# EAGLE design electronic_load_chip (EAGLE 7.3.0)

## Sheet 1 of 2
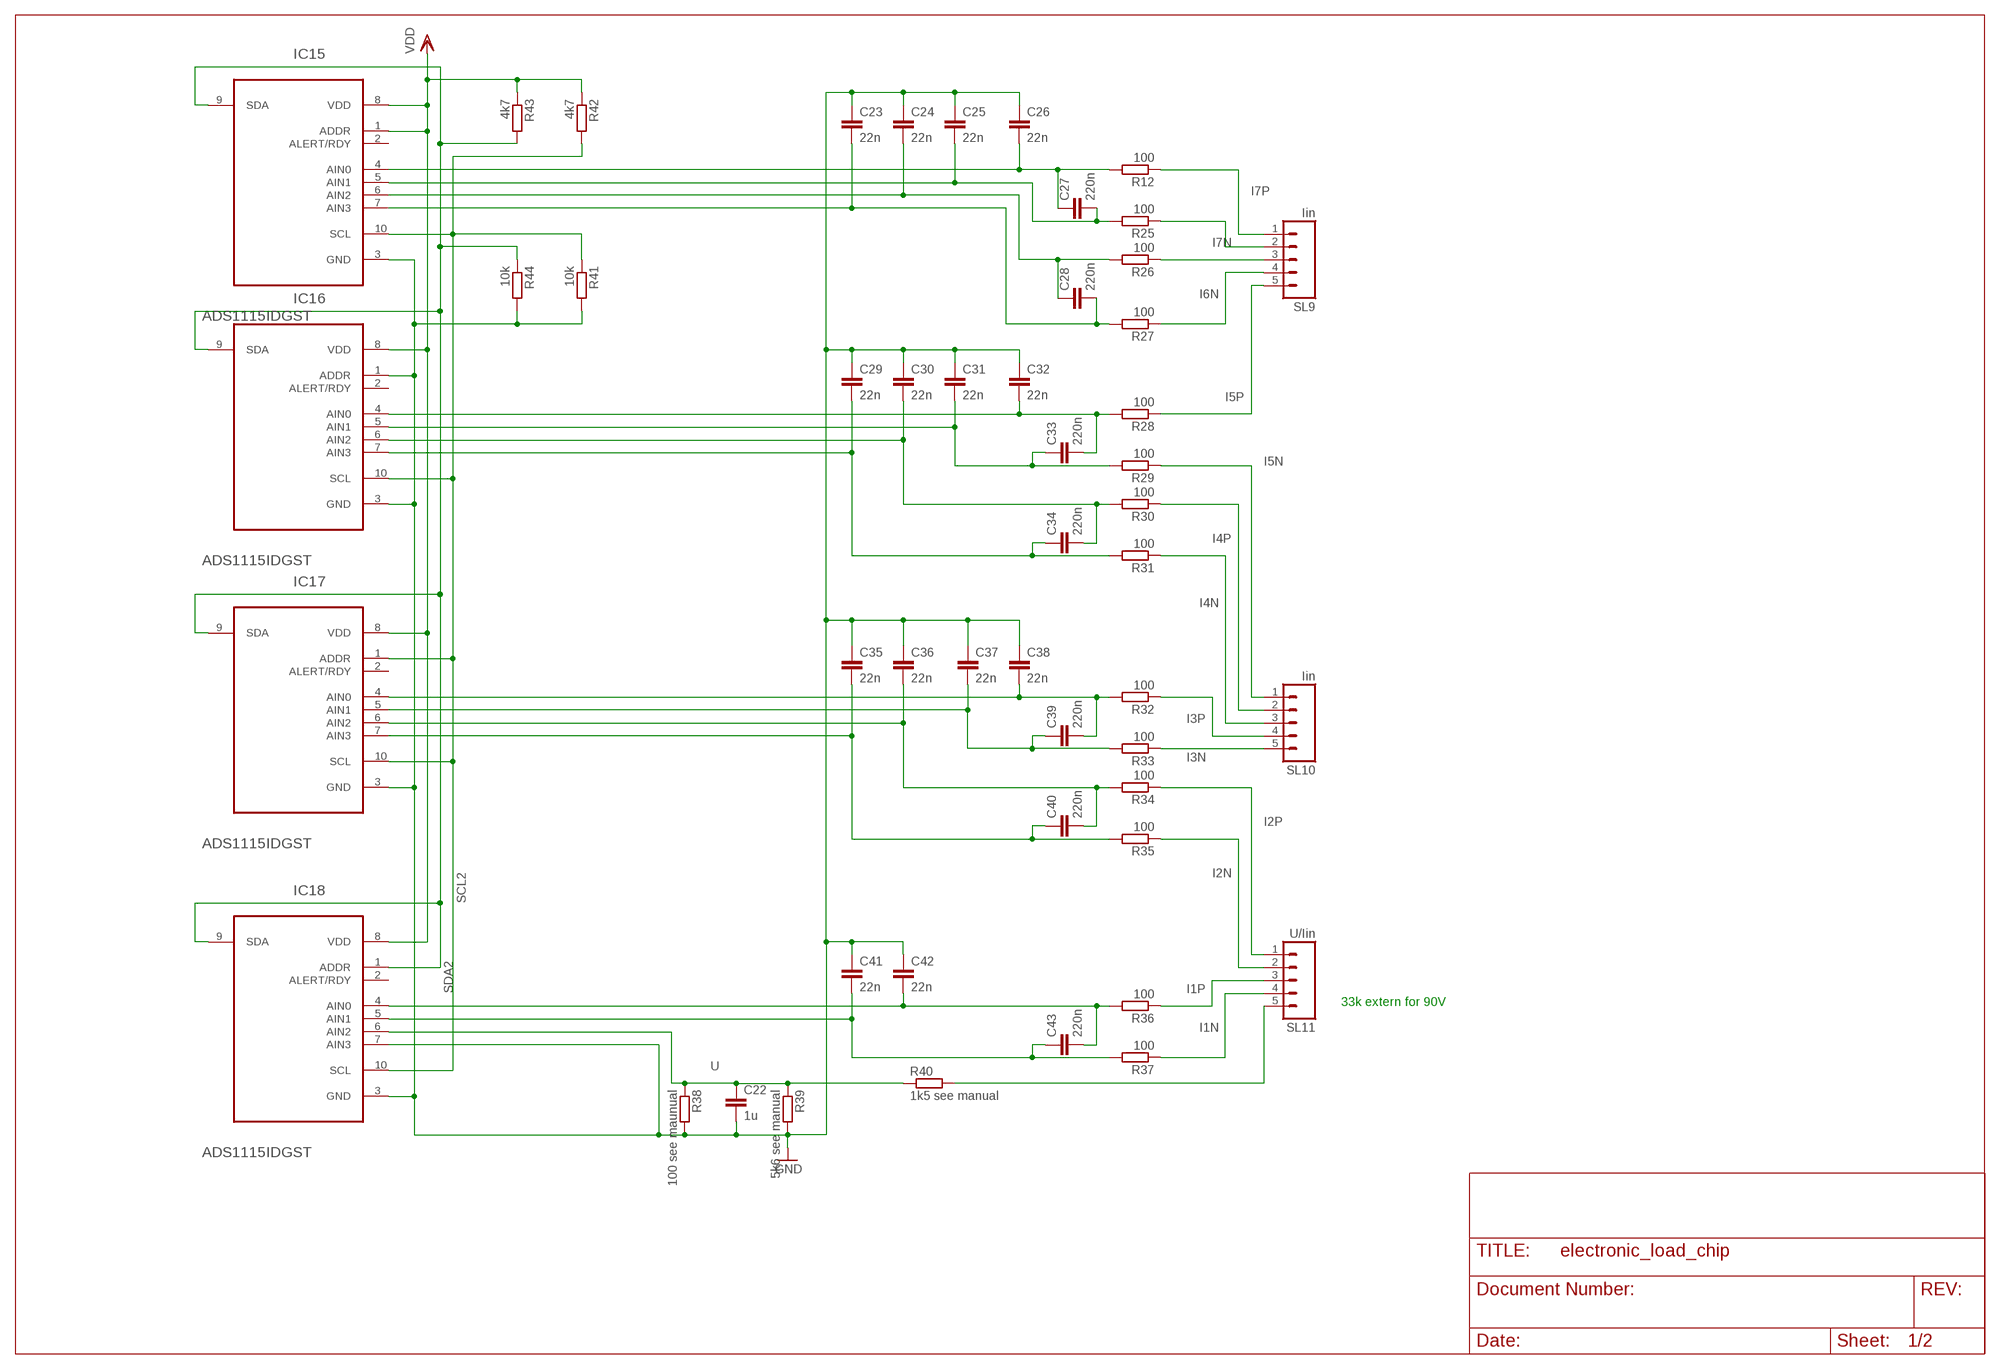
[diagram p0: schematic, sheet 1]

### Parts
C22  1u  C-EUC1206  [C1206]
C23  22n  C-EUC1206  [C1206]
C24  22n  C-EUC1206  [C1206]
C25  22n  C-EUC1206  [C1206]
C26  22n  C-EUC1206  [C1206]
C27  220n  C-EUC1206  [C1206]
C28  220n  C-EUC1206  [C1206]
C29  22n  C-EUC1206  [C1206]
C30  22n  C-EUC1206  [C1206]
C31  22n  C-EUC1206  [C1206]
C32  22n  C-EUC1206  [C1206]
C33  220n  C-EUC1206  [C1206]
C34  220n  C-EUC1206  [C1206]
C35  22n  C-EUC1206  [C1206]
C36  22n  C-EUC1206  [C1206]
C37  22n  C-EUC1206  [C1206]
C38  22n  C-EUC1206  [C1206]
C39  220n  C-EUC1206  [C1206]
C40  220n  C-EUC1206  [C1206]
C41  22n  C-EUC1206  [C1206]
C42  22n  C-EUC1206  [C1206]
C43  220n  C-EUC1206  [C1206]
IC15  ADS1115IDGST  [SOP50P490X110-10N]
IC16  ADS1115IDGST  [SOP50P490X110-10N]
IC17  ADS1115IDGST  [SOP50P490X110-10N]
IC18  ADS1115IDGST  [SOP50P490X110-10N]
R12  100  R-EU_R1206  [R1206]
R25  100  R-EU_R1206  [R1206]
R26  100  R-EU_R1206  [R1206]
R27  100  R-EU_R1206  [R1206]
R28  100  R-EU_R1206  [R1206]
R29  100  R-EU_R1206  [R1206]
R30  100  R-EU_R1206  [R1206]
R31  100  R-EU_R1206  [R1206]
R32  100  R-EU_R1206  [R1206]
R33  100  R-EU_R1206  [R1206]
R34  100  R-EU_R1206  [R1206]
R35  100  R-EU_R1206  [R1206]
R36  100  R-EU_R1206  [R1206]
R37  100  R-EU_R1206  [R1206]
R38  100 see maunual  R-EU_R1206  [R1206]
R39  5k6 see manual  R-EU_R1206  [R1206]
R40  1k5 see manual  R-EU_R1206  [R1206]
R41  10k  R-EU_R1206  [R1206]
R42  4k7  R-EU_R1206  [R1206]
R43  4k7  R-EU_R1206  [R1206]
R44  10k  R-EU_R1206  [R1206]
SL9  Iin  M05  [05P]
SL10  Iin  M05  [05P]
SL11  U/Iin  M05  [05P]

### Nets
GND: C22.2 C23.1 C24.1 C25.1 C26.1 C29.1 C30.1 C31.1 C32.1 C35.1 C36.1 C37.1 C38.1 C41.1 C42.1 IC15.3(GND) IC16.1(ADDR) IC16.3(GND) IC17.3(GND) IC18.3(GND) IC18.7(AIN3) R38.2 R39.2 R41.2 R44.2 ; also sheet 2
I1N: R37.1 SL11.4
I1P: R36.1 SL11.3
I2N: R35.1 SL11.2
I2P: R34.1 SL11.1
I3N: R33.1 SL10.5
I3P: R32.1 SL10.4
I4N: R31.1 SL10.3
I4P: R30.1 SL10.2
I5N: R29.1 SL10.1
I5P: R28.1 SL9.5
I6N: R27.1 SL9.4
I6P: R26.1 SL9.3
I7N: R25.1 SL9.2
I7P: R12.1 SL9.1
N$1: C26.2 C27.1 IC15.4(AIN0) R12.2
N$8: C32.2 C33.2 IC16.4(AIN0) R28.2
N$27: R40.2 SL11.5
N$29: C31.2 C33.1 IC16.5(AIN1) R29.2
N$30: C30.2 C34.2 IC16.6(AIN2) R30.2
N$32: C29.2 C34.1 IC16.7(AIN3) R31.2
N$45: C38.2 C39.2 IC17.4(AIN0) R32.2
N$48: C37.2 C39.1 IC17.5(AIN1) R33.2
N$49: C36.2 C40.2 IC17.6(AIN2) R34.2
N$70: C24.2 C28.1 IC15.6(AIN2) R26.2
N$71: C25.2 C27.2 IC15.5(AIN1) R25.2
N$72: C35.2 C40.1 IC17.7(AIN3) R35.2
N$74: C23.2 C28.2 IC15.7(AIN3) R27.2
N$76: C42.2 C43.2 IC18.4(AIN0) R36.2
N$78: C41.2 C43.1 IC18.5(AIN1) R37.2
SCL2: IC15.10(SCL) IC16.10(SCL) IC17.1(ADDR) IC17.10(SCL) IC18.10(SCL) R41.1 R42.2 ; also sheet 2
SDA2: IC15.9(SDA) IC16.9(SDA) IC17.9(SDA) IC18.1(ADDR) IC18.9(SDA) R43.2 R44.1 ; also sheet 2
U: C22.1 IC18.6(AIN2) R38.1 R39.1 R40.1
VDD: IC15.1(ADDR) IC15.8(VDD) IC16.8(VDD) IC17.8(VDD) IC18.8(VDD) R42.1 R43.1 ; also sheet 2
Unconnected: IC15.2(ALERT/RDY) IC16.2(ALERT/RDY) IC17.2(ALERT/RDY) IC18.2(ALERT/RDY)

### Notes on the sheet
- 33k extern for 90V

## Sheet 2 of 2
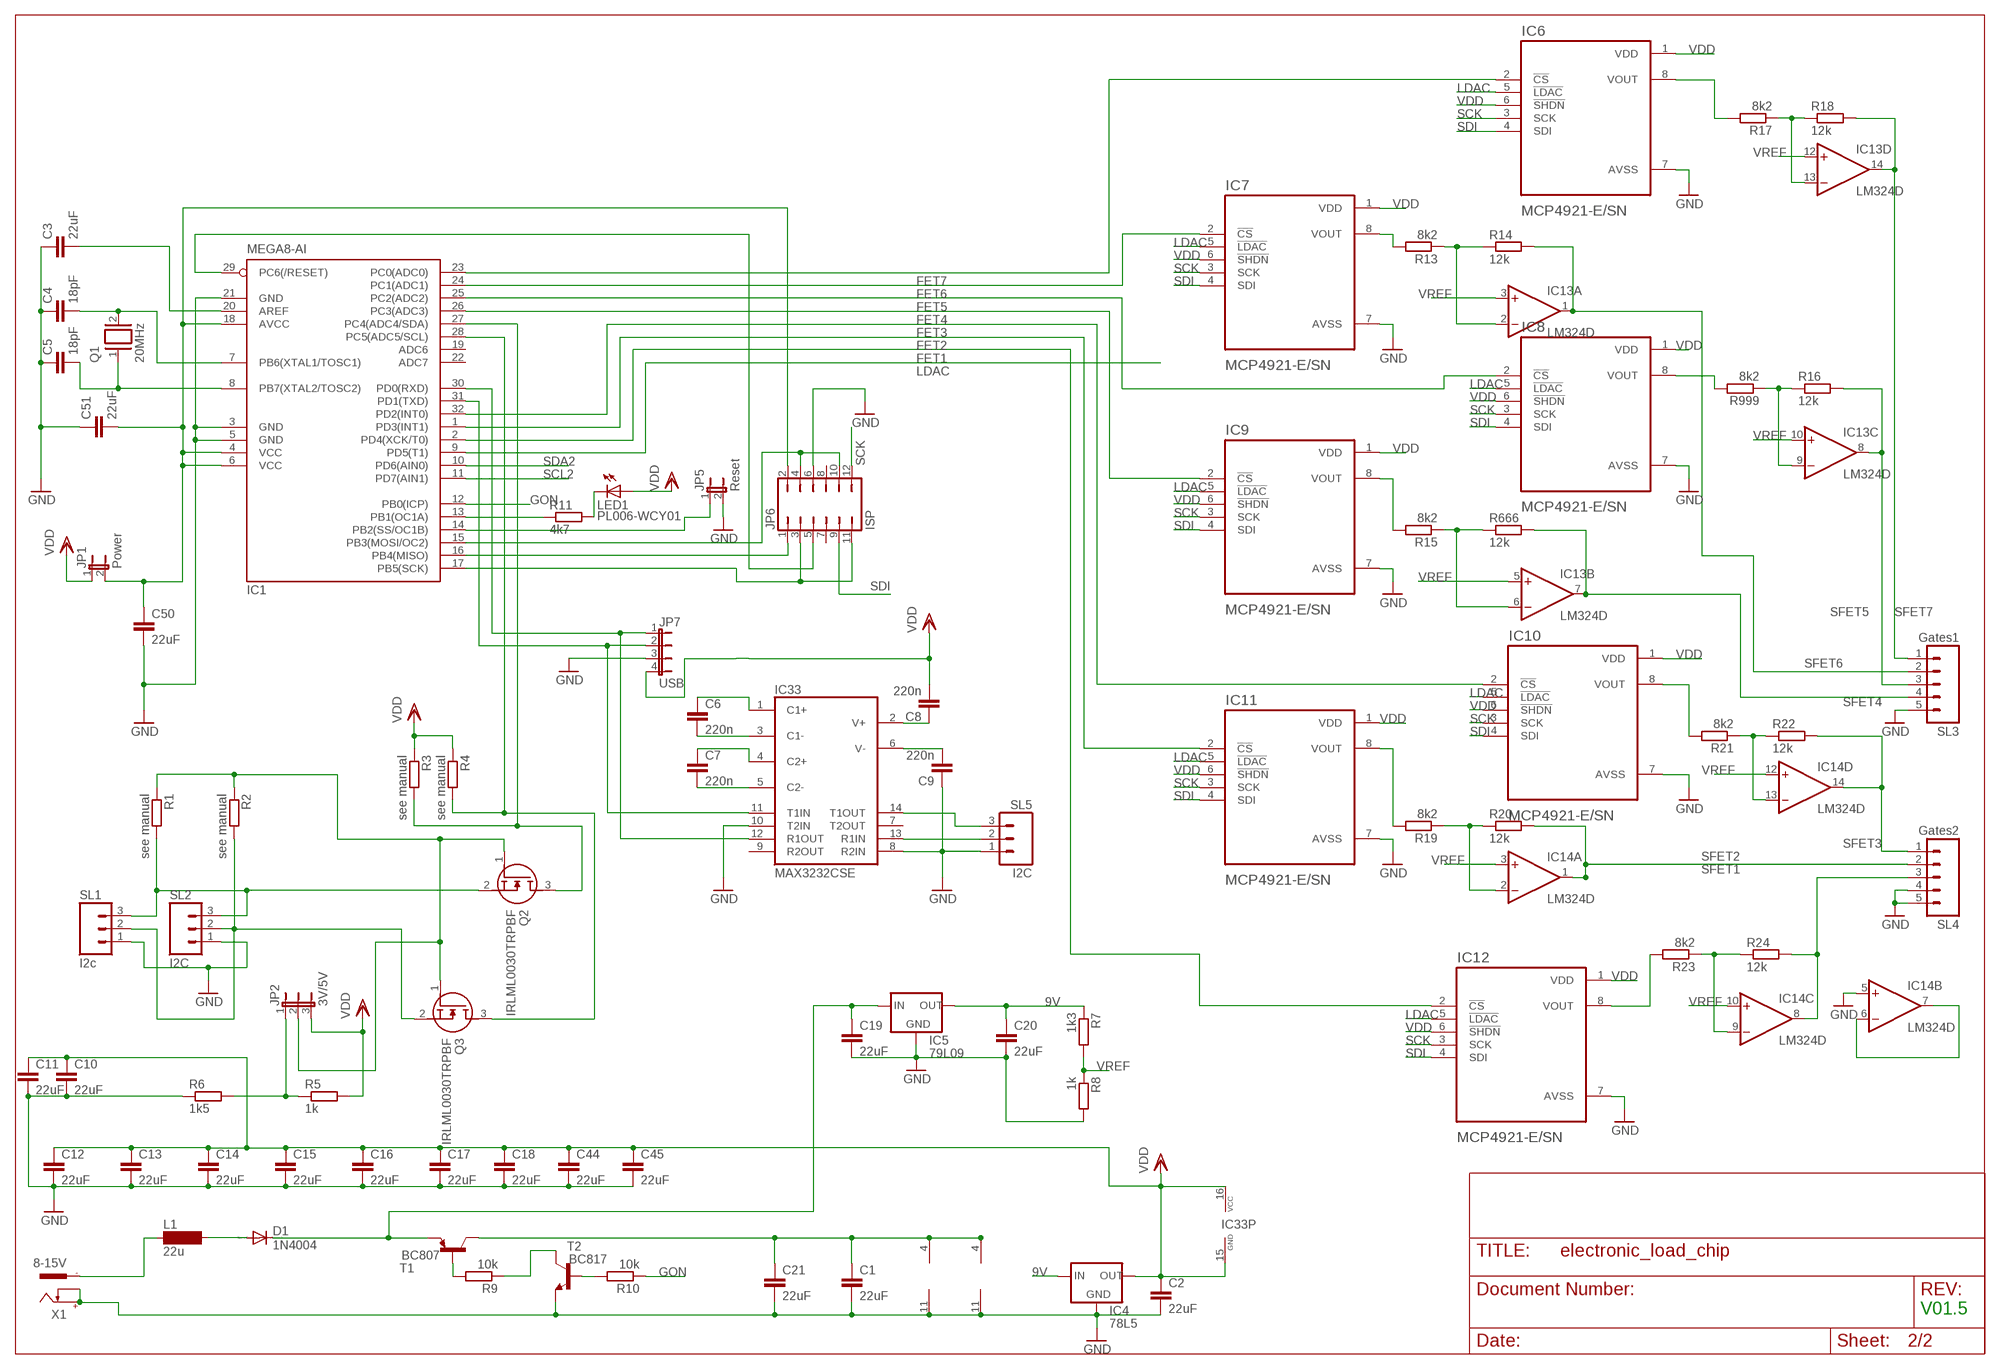
[diagram p1: schematic, sheet 2]

### Parts
C1  22uF  C-EUC1206  [C1206]
C2  22uF  C-EUC1206  [C1206]
C3  22uF  C-EUC1206  [C1206]
C4  18pF  C-EU025-025X050  [C025-025X050]
C5  18pF  C-EU025-025X050  [C025-025X050]
C6  220n  C-EUC1206  [C1206]
C7  220n  C-EUC1206  [C1206]
C8  220n  C-EUC1206  [C1206]
C9  220n  C-EUC1206  [C1206]
C10  22uF  C-EUC1206  [C1206]
C11  22uF  C-EUC1206  [C1206]
C12  22uF  C-EUC1206  [C1206]
C13  22uF  C-EUC1206  [C1206]
C14  22uF  C-EUC1206  [C1206]
C15  22uF  C-EUC1206  [C1206]
C16  22uF  C-EUC1206  [C1206]
C17  22uF  C-EUC1206  [C1206]
C18  22uF  C-EUC1206  [C1206]
C19  22uF  C-EUC1206  [C1206]
C20  22uF  C-EUC1206  [C1206]
C21  22uF  C-EUC1206  [C1206]
C44  22uF  C-EUC1206  [C1206]
C45  22uF  C-EUC1206  [C1206]
C50  22uF  C-EUC1206  [C1206]
C51  22uF  C-EUC1206  [C1206]
D1  1N4004  [DO41-10]
IC1  MEGA8-AI  [TQFP32-08]
IC4  78L5  78LXX  [78LXX]
IC5  79L09  78LXX  [78LXX]
IC6  MCP4921-E/SN  [SOIC127P600X175-8N]
IC7  MCP4921-E/SN  [SOIC127P600X175-8N]
IC8  MCP4921-E/SN  [SOIC127P600X175-8N]
IC9  MCP4921-E/SN  [SOIC127P600X175-8N]
IC10  MCP4921-E/SN  [SOIC127P600X175-8N]
IC11  MCP4921-E/SN  [SOIC127P600X175-8N]
IC12  MCP4921-E/SN  [SOIC127P600X175-8N]
IC13  LM324D  [SO14]
IC14  LM324D  [SO14]
IC33  MAX3232CSE  [SO16]
JP1  Power  JP1E  [JP1]
JP2  3V/5V  JP2E  [JP2]
JP5  Reset  JP1E  [JP1]
JP6  ISP  JP6Q  [JP6Q]
JP7  USB  JP4E  [JP4]
L1  22u  MS85  [MS85]
LED1  PL006-WCY01  [SOT23]
Q1  20MHz  XTAL/S  [QS]
Q2  IRLML0030TRPBF  [SOT95P237X112-3N]
Q3  IRLML0030TRPBF  [SOT95P237X112-3N]
R1  see manual  R-EU_R1206  [R1206]
R2  see manual  R-EU_R1206  [R1206]
R3  see manual  R-EU_R1206  [R1206]
R4  see manual  R-EU_R1206  [R1206]
R5  1k  R-EU_R1206  [R1206]
R6  1k5  R-EU_R1206  [R1206]
R7  1k3  R-EU_R1206  [R1206]
R8  1k  R-EU_R1206  [R1206]
R9  10k  R-EU_R1206  [R1206]
R10  10k  R-EU_R1206  [R1206]
R11  4k7  R-EU_R1206  [R1206]
R13  8k2  R-EU_R1206  [R1206]
R14  12k  R-EU_R1206  [R1206]
R15  8k2  R-EU_R1206  [R1206]
R16  12k  R-EU_R1206  [R1206]
R17  8k2  R-EU_R1206  [R1206]
R18  12k  R-EU_R1206  [R1206]
R19  8k2  R-EU_R1206  [R1206]
R20  12k  R-EU_R1206  [R1206]
R21  8k2  R-EU_R1206  [R1206]
R22  12k  R-EU_R1206  [R1206]
R23  8k2  R-EU_R1206  [R1206]
R24  12k  R-EU_R1206  [R1206]
R666  12k  R-EU_R1206  [R1206]
R999  8k2  R-EU_R1206  [R1206]
SL1  I2c  M03  [03P]
SL2  I2C  M03  [03P]
SL3  Gates1  M05  [05P]
SL4  Gates2  M05  [05P]
SL5  I2C  M03  [03P]
T1  BC807  BC807-16-PNP-SOT23-BEC  [SOT23-BEC]
T2  BC817  BC817-16-NPN-SOT23-BEC  [SOT23-BEC]
X1  8-15V  737992-55  [737992-5]

### Nets
9V: C20.1 IC4.IN IC5.OUT R7.1
C13: C6.1 IC33.1(C1+)
FET1: IC1.2(PD4(XCK/T0)) IC12.2(!CS)
FET2: IC1.1(PD3(INT1)) IC11.2(!CS)
FET3: IC1.32(PD2(INT0)) IC10.2(!CS)
FET4: IC1.26(PC3(ADC3)) IC9.2(!CS)
FET5: IC1.25(PC2(ADC2)) IC8.2(!CS)
FET6: IC1.24(PC1(ADC1)) IC7.2(!CS)
FET7: IC1.23(PC0(ADC0)) IC6.2(!CS)
GND: C1.2 C2.2 C3.1 C4.1 C5.1 C9.1 C10.2 C11.2 C12.2 C13.2 C14.2 C15.2 C16.2 C17.2 C18.2 C19.2 C20.2 C21.2 C44.2 C45.2 C50.2 C51.1 IC1.3(GND) IC1.5(GND) IC1.21(GND) IC4.GND IC5.GND IC6.7(AVSS) IC7.7(AVSS) IC8.7(AVSS) IC9.7(AVSS) IC10.7(AVSS) IC11.7(AVSS) IC12.7(AVSS) IC13.11(P:V-) IC14.5(B:+IN) IC14.11(P:V-) IC33.8(R2IN) IC33.10(T2IN) JP5.2 JP6.6 JP7.3 R6.1 R8.2 SL1.1 SL2.1 SL3.5 SL4.4 SL4.5 SL5.1 T2.E X1.+ X1.K ; also sheet 1
GON: IC1.12(PB0(ICP)) R10.1
LDAC: IC1.9(PD5(T1)) IC6.5(!LDAC) IC7.5(!LDAC) IC8.5(!LDAC) IC9.5(!LDAC) IC10.5(!LDAC) IC11.5(!LDAC) IC12.5(!LDAC)
N$2: IC8.8(VOUT) R999.2
N$3: C7.2 IC33.5(C2-)
N$4: C50.1 C51.2 IC1.4(VCC) IC1.6(VCC) IC1.18(AVCC) JP1.2 JP6.2
N$5: Q2.2(S) R1.2 SL1.3 SL2.3
N$6: IC1.31(PD1(TXD)) IC33.11(T1IN) JP7.2
N$7: L1.1 X1.-1
N$9: IC33.13(R1IN) SL5.2
N$11: C5.2 IC1.8(PB7(XTAL2/TOSC2)) Q1.1
N$12: D1.A L1.2
N$13: C7.1 IC33.4(C2+)
N$14: C6.2 IC33.3(C1-)
N$15: IC1.16(PB4(MISO)) JP6.1
N$16: C8.1 IC33.2(V+)
N$17: C9.2 IC33.6(V-)
N$18: IC1.29(PC6(/RESET)) JP6.5
N$19: C4.2 IC1.7(PB6(XTAL1/TOSC1)) Q1.2
N$20: IC12.8(VOUT) R23.2
N$21: IC6.8(VOUT) R17.2
N$22: Q3.2(S) R2.2 SL1.2 SL2.2
N$23: IC1.15(PB3(MOSI/OC2)) JP6.4 JP6.10
N$26: IC11.8(VOUT) R19.2
N$31: IC7.8(VOUT) R13.2
N$33: IC33.14(T1OUT) SL5.3
N$35: IC1.27(PC4(ADC4/SDA)) Q2.3(D) R3.2
N$36: IC13.13(D:-IN) R17.1 R18.1
N$37: IC1.14(PB2(SS/OC1B)) JP5.1
N$38: IC13.9(C:-IN) R16.1 R999.1
N$40: IC14.13(D:-IN) R21.1 R22.1
N$41: IC10.8(VOUT) R21.2
N$42: IC1.30(PD0(RXD)) IC33.12(R1OUT) JP7.1
N$43: LED1.3(C) R11.2
N$46: IC1.17(PB5(SCK)) JP6.3 JP6.11
N$50: IC1.28(PC5(ADC5/SCL)) Q3.3(D) R4.2
N$51: JP2.1 R5.1 R6.2
N$52: IC9.8(VOUT) R15.2
N$54: IC1.13(PB1(OC1A)) R11.1
N$56: C19.1 D1.C IC5.IN T1.E
N$57: IC14.2(A:-IN) R19.1 R20.1
N$58: IC14.9(C:-IN) R23.1 R24.1
N$59: C1.1 C21.1 IC13.4(P:V+) IC14.4(P:V+) T1.C
N$60: C3.2 IC1.20(AREF)
N$61: R9.2 T1.B
N$62: JP2.2 Q2.1(G) Q3.1(G) R1.1 R2.1
N$63: R9.1 T2.C
N$64: R10.2 T2.B
N$73: IC13.6(B:-IN) R15.1 R666.1
N$91: IC13.2(A:-IN) R13.1 R14.1
N$96: IC14.6(B:-IN) IC14.7(B:OUT)
SCK: IC6.3(SCK) IC7.3(SCK) IC8.3(SCK) IC9.3(SCK) IC10.3(SCK) IC11.3(SCK) IC12.3(SCK) JP6.12
SCL2: IC1.11(PD7(AIN1)) ; also sheet 1
SDA2: IC1.10(PD6(AIN0)) ; also sheet 1
SDI: IC6.4(SDI) IC7.4(SDI) IC8.4(SDI) IC9.4(SDI) IC10.4(SDI) IC11.4(SDI) IC12.4(SDI) JP6.9
SFET1: IC14.8(C:OUT) R24.2 SL4.3
SFET2: IC14.1(A:OUT) R20.2 SL4.2
SFET3: IC14.14(D:OUT) R22.2 SL4.1
SFET4: IC13.7(B:OUT) R666.2 SL3.4
SFET5: IC13.8(C:OUT) R16.2 SL3.3
SFET6: IC13.1(A:OUT) R14.2 SL3.2
SFET7: IC13.14(D:OUT) R18.2 SL3.1
VDD: C2.1 C8.2 C10.1 C11.1 C12.1 C13.1 C14.1 C15.1 C16.1 C17.1 C18.1 C44.1 C45.1 IC4.OUT IC6.1(VDD) IC6.6(!SHDN) IC7.1(VDD) IC7.6(!SHDN) IC8.1(VDD) IC8.6(!SHDN) IC9.1(VDD) IC9.6(!SHDN) IC10.1(VDD) IC10.6(!SHDN) IC11.1(VDD) IC11.6(!SHDN) IC12.1(VDD) IC12.6(!SHDN) IC33.15(GND) IC33.16(VCC) JP1.1 JP2.3 JP7.4 LED1.1(A) R3.1 R4.1 R5.2 ; also sheet 1
VREF: IC13.3(A:+IN) IC13.5(B:+IN) IC13.10(C:+IN) IC13.12(D:+IN) IC14.3(A:+IN) IC14.10(C:+IN) IC14.12(D:+IN) R7.2 R8.1
Unconnected: IC1.19(ADC6) IC1.22(ADC7) IC33.7(T2OUT) IC33.9(R2OUT) JP6.7 JP6.8 X1.-2

### Notes on the sheet
- V01.5

## Library data of the parts
C1-C3 C6-C21 C44 C45 C50 C51 = rcl:C-EU: CAPACITOR, European symbol
C4 C5 C22-C43 = resistor:C-EU: CAPACITOR, European symbol
D1 = diode:1N4004: DIODE general purpose rectifier, 1 A
IC1 = atmel:MEGA8: MICROCONTROLLER 8 Kbytes FLASH, 1 kbytes SRAM, 512 bytes EEPROM, USART, 6-channel 10 bit ADC, 2-channel 8 bit ADC Pin compatible with Atmega48, ATMega88, ATMega168 Source: avr.lbr; MPN: ATMEGA8-16AU; OC_FARNELL: 9171371; OC_NEWARK: 73M8863
IC4 IC5 = v-reg:78LXX: VOLTAGE REGULATOR
IC6-IC12 = MCP4921-E_SN:MCP4921-E/SN; AVAILABILITY: Unavailable; DESCRIPTION: 12 Bit Digital to Analog Converter 1 8-SOIC; MF: Microchip; MP: MCP4921-E/SN; PACKAGE: SOIC-8 Microchip; PRICE: None
IC13 IC14 = linear:LM324: OP AMP
IC15-IC18 = ADS1115IDGST:ADS1115IDGST: Analog-to-Digital Converter with Internal Reference; DESCRIPTION: 16 Bit Analog to Digital Converter 2, 4 Input 1 Sigma-Delta 10-VSSOP; MF: Texas Instruments; MP: ADS1115IDGST; PACKAGE: MSOP-10 Texas Instruments
IC33 = maxim:MAX3232*: True RS-232 Transceivers 3.0V to 5.5V, Low-Power up to 1Mbps, Using Four 0.1µF External Capacitors Source: http://pdfserv.maxim-ic.com/en/ds/MAX3222-MAX3241.pdf; MPN: MAX3232CSE; OC_FARNELL: 9725490; OC_NEWARK: 90C2890
JP1 JP5 = jumper:JP1E: JUMPER
JP2 = jumper:JP2E: JUMPER
JP6 = jumper:JP6Q: JUMPER
JP7 = jumper:JP4E: JUMPER
L1 = inductor-neosid:MS85: INDUCTOR SMD power inductor; OC_FARNELL: unknown; OC_NEWARK: unknown
LED1 = led:PL006*: PLH006 Series SMD LED SOT23 PLH006-WCR21 Super Red PLH006-WCR12 High Eff Red PLH006-WCG13 Green PLH006-WCY01 Yellow www.p-tec.net Source: http://www.wittig-electronic.de/PTEC/PL006Series.pdf
Q1 = special:XTAL/S: CRYSTAL
Q2 Q3 = IRLML0030TRPBF:IRLML0030TRPBF: INTERNATIONAL RECTIFIER - IRLML0030TRPBF - MOSFET, N CH, 30V, 5.3A, SOT23-3 Source: Datasheet <https://componentsearchengine.com/Datasheets/2/IRLML0030TRPBF.pdf>; AVAILABILITY: Unavailable; DESCRIPTION: RoHS Compliant | Low RDS(on) | Industry-Standard Pinout | Compatible with Existing Surface Mount Techniques | Qualified Industrial | Qualified MSL1 | SOT-23 Footprint; MF: Infineon Technologies; MP: IRLML0030TRPBF; PACKAGE: SOT-23-3 Infineon; PRICE: None
R1-R44 R666 R999 = resistor:R-EU_: RESISTOR, European symbol
SL1 SL2 SL5 = con-amp-quick:M03: AMP QUICK CONNECTOR; OC_FARNELL: unknown; OC_NEWARK: unknown
SL3 SL4 SL9-SL11 = con-amp-quick:M05: AMP QUICK CONNECTOR; OC_FARNELL: unknown; OC_NEWARK: unknown
T1 = transistor:*-PNP-: PNP Transistror
T2 = transistor:*-NPN-: NPN Transistror BF959 corrected 2008.03.06
X1 = con-conrad:737992-55: FEMALE PRINT CONNECTOR DIN 45323 (34V/3A), ROKA, distributor Conrad

## Board
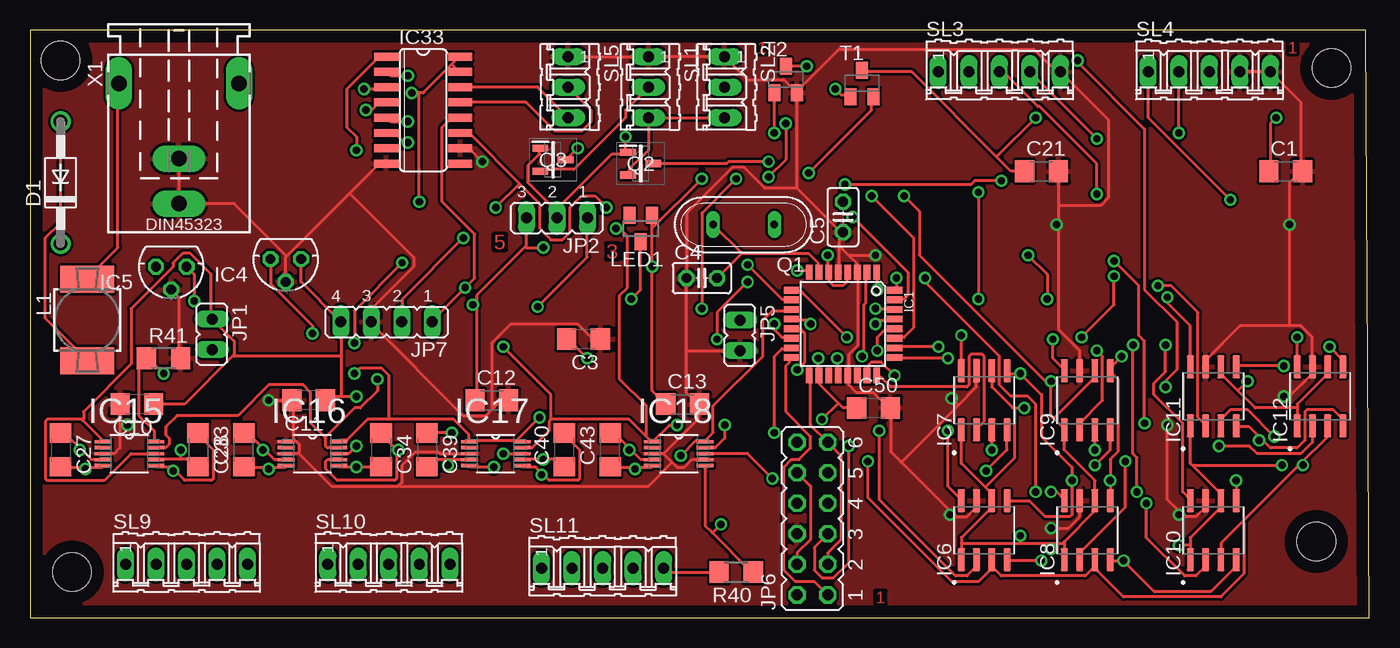
[diagram p2: board, top side]
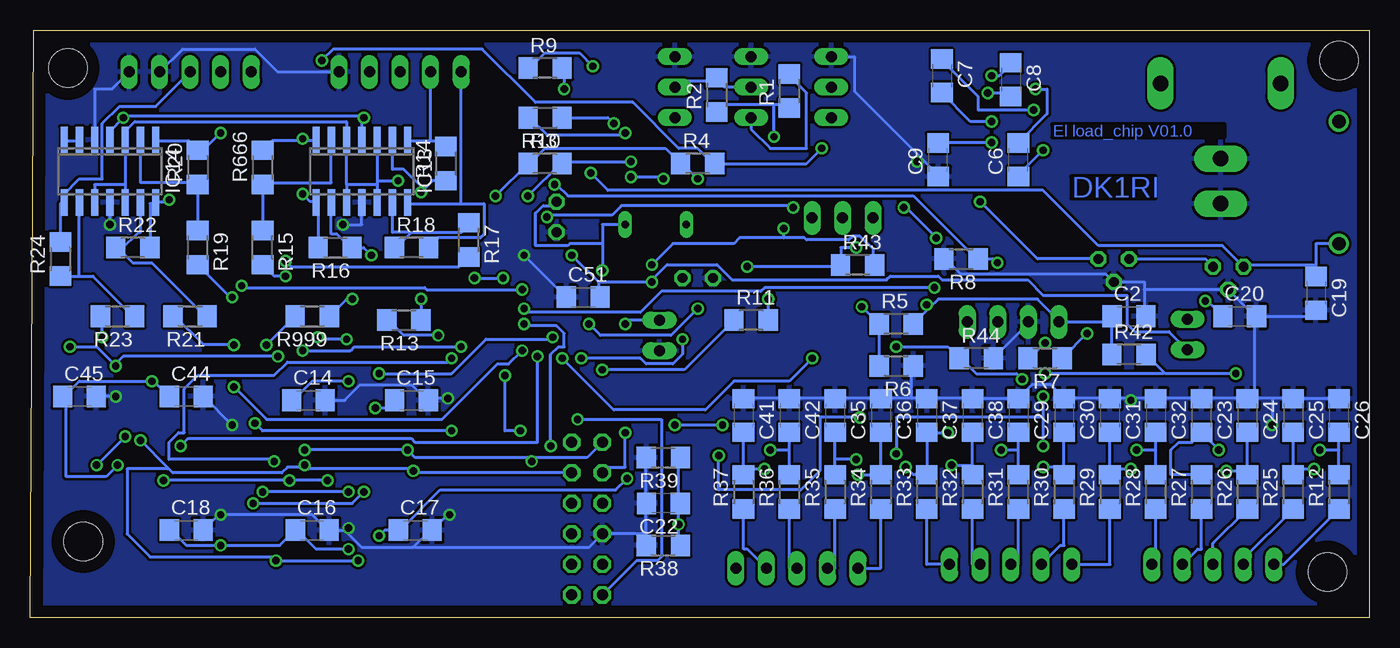
[diagram p3: board, bottom side, seen from below]

Size 111.42 x 48.88 mm. Coordinates in mm from the lower left corner, seen from the top.
Outline: 0,0 111.42,0 111.1,48.88 0,48.88 0,0
Copper layers (1*16): Top 0.035mm / dielectric 1.5mm / Bottom 0.035mm
Design rules "default": minimum track width 10mil, minimum drill 24mil, track to track 8mil, track to pad 8mil, pad to pad 8mil, via to via 8mil, smd to smd 8mil, copper to edge 40mil, drill to drill 8mil, minimum pad ring 10mil, minimum via ring 8mil, stop-mask expansion 4mil, vias tented up to drill 0mil, thermal gap 10mil
Holes 3.2 mm at 2.54,46.35 3.49,3.81 107,6.35 108.27,45.72

### Footprints (pad centres in the part's own frame; a part is rotated, then mirrored left to right if it is on the bottom)
C1206 = smd 1.6 x 1.8: 1 -1.4,0; 2 1.4,0
C025-025X050 = drill 0.813 octagon: 1 -1.27,0; 2 1.27,0
DO41-10 = drill 1.118: A 5.08,0; C -5.08,0
TQFP32-08 = smd 1.27 x 0.559: 1 -4.293,2.8; 2 -4.293,2; 3 -4.293,1.2; 4 -4.293,0.4; 5 -4.293,-0.4; 6 -4.293,-1.2; 7 -4.293,-2; 8 -4.293,-2.8; 17 4.293,-2.8; 18 4.293,-2; 19 4.293,-1.2; 20 4.293,-0.4; 21 4.293,0.4; 22 4.293,1.2; 23 4.293,2; 24 4.293,2.8 | smd 0.559 x 1.27: 9 -2.8,-4.293; 10 -2,-4.293; 11 -1.2,-4.293; 12 -0.4,-4.293; 13 0.4,-4.293; 14 1.2,-4.293; 15 2,-4.293; 16 2.8,-4.293; 25 2.8,4.293; 26 2,4.293; 27 1.2,4.293; 28 0.4,4.293; 29 -0.4,4.293; 30 -1.2,4.293; 31 -2,4.293; 32 -2.8,4.293
78LXX = drill 0.813 octagon: GND 0,1.905; IN 1.27,0; OUT -1.27,0
SOIC127P600X175-8N = smd 1.9 x 0.6: 1 -2.455,1.905; 2 -2.455,0.635; 3 -2.455,-0.635; 4 -2.455,-1.905; 5 2.455,-1.905; 6 2.455,-0.635; 7 2.455,0.635; 8 2.455,1.905
SO14 = smd 0.6 x 2.2: 1 -3.81,-2.6; 2 -2.54,-2.6; 3 -1.27,-2.6; 4 0,-2.6; 5 1.27,-2.6; 6 2.54,-2.6; 7 3.81,-2.6; 8 3.81,2.6; 9 2.54,2.6; 10 1.27,2.6; 11 0,2.6; 12 -1.27,2.6; 13 -2.54,2.6; 14 -3.81,2.6
SOP50P490X110-10N = smd 1.422 x 0.279: 1 -2.184,0.991; 2 -2.184,0.508; 3 -2.184,0; 4 -2.184,-0.508; 5 -2.184,-0.991; 6 2.184,-0.991; 7 2.184,-0.508; 8 2.184,0; 9 2.184,0.508; 10 2.184,0.991
SO16 = smd 0.66 x 2.032: 1 -4.445,-3.073; 2 -3.175,-3.073; 3 -1.905,-3.073; 4 -0.635,-3.073; 5 0.635,-3.073; 6 1.905,-3.073; 7 3.175,-3.073; 8 4.445,-3.073; 9 4.445,3.073; 10 3.175,3.073; 11 1.905,3.073; 12 0.635,3.073; 13 -0.635,3.073; 14 -1.905,3.073; 15 -3.175,3.073; 16 -4.445,3.073
JP1 = drill 0.914 long: 1 0,-1.27; 2 0,1.27
JP2 = drill 0.914 long: 1 -2.54,0; 2 0,0; 3 2.54,0
JP6Q = drill 0.914 octagon: 1 -6.35,-1.27; 2 -6.35,1.27; 3 -3.81,-1.27; 4 -3.81,1.27; 5 -1.27,-1.27; 6 -1.27,1.27; 7 1.27,-1.27; 8 1.27,1.27; 9 3.81,-1.27; 10 3.81,1.27; 11 6.35,-1.27; 12 6.35,1.27
JP4 = drill 0.914 long: 1 -3.81,0; 2 -1.27,0; 3 1.27,0; 4 3.81,0
MS85 = smd 4.5 x 2.25: 1 0,-3.383; 2 0,3.383
SOT23 = smd 1 x 1.4: 1 -0.95,-1.1; 2 0.95,-1.1; 3 0,1.1
QS = drill 0.61 long: 1 -2.54,0; 2 2.54,0
SOT95P237X112-3N = smd 1.3 x 0.6: 1 -1.05,0.95; 2 -1.05,-0.95; 3 1.05,0
R1206 = smd 1.6 x 1.803: 1 -1.422,0; 2 1.422,0
03P = drill 0.914 long: 1 -2.54,0; 2 0,0; 3 2.54,0
05P = drill 0.914 long: 1 -5.08,0; 2 -2.54,0; 3 0,0; 4 2.54,0; 5 5.08,0
SOT23-BEC = smd 1 x 1.4: B -0.95,-1.1; C 0,1.1; E 0.95,-1.1
737992-5 = drill 1.3 pad 2.184 long: + 0,10; -1 5,0; -2 -5,0; K 0,6.25

### Placement (x,y rotation side)
C1  104.46,37.15 0 top
C2  20,25.08 0 bottom
C3  46.04,23.18 180 top
C4  55.88,28.26 0 top
C5  67.63,33.34 90 top
C6  29.21,38.1 90 bottom
C7  35.56,45.09 270 bottom
C8  29.85,44.77 270 bottom
C9  35.88,38.1 90 bottom
C10  8.89,17.78 180 top
C11  23.18,18.1 180 top
C12  38.42,18.1 0 top
C13  54.29,17.78 0 top
C14  88.27,18.1 0 bottom
C15  79.69,18.1 0 bottom
C16  87.95,7.3 0 bottom
C17  79.38,7.3 0 bottom
C18  98.43,7.3 0 bottom
C19  4.45,26.99 270 bottom
C20  10.79,25.08 0 bottom
C21  84.14,37.15 0 top
C22  58.74,9.53 180 bottom
C23  13.97,16.83 270 bottom
C24  10.16,16.83 270 bottom
C25  6.35,16.83 270 bottom
C26  2.54,16.83 270 bottom
C27  2.54,13.97 270 top
C28  13.97,13.97 270 top
C29  29.21,16.83 270 bottom
C30  25.4,16.83 270 bottom
C31  21.59,16.83 270 bottom
C32  17.78,16.83 270 bottom
C33  17.78,13.97 90 top
C34  29.21,13.97 270 top
C35  44.45,16.83 270 bottom
C36  40.64,16.83 270 bottom
C37  36.83,16.83 270 bottom
C38  33.02,16.83 270 bottom
C39  33.02,13.97 270 top
C40  44.45,13.97 90 top
C41  52.07,16.83 270 bottom
C42  48.26,16.83 270 bottom
C43  48.26,13.97 90 top
C44  98.43,18.41 0 bottom
C45  107.31,18.41 0 bottom
C50  70.17,17.46 0 top
C51  65.41,26.67 0 bottom
D1  2.54,36.2 90 top
IC1  67.63,24.45 270 top
IC4  21.27,29.84 180 top
IC5  11.75,29.21 180 top
IC6  79.38,7.3 90 top
IC7  79.38,18.1 90 top
IC8  87.95,7.3 90 top
IC9  87.95,18.1 90 top
IC10  98.43,7.3 90 top
IC11  98.43,18.41 90 top
IC12  107.31,18.41 90 top
IC13  83.82,37.15 180 bottom
IC14  104.78,37.15 180 bottom
IC15  8.25,13.65 0 top
IC16  23.5,13.65 0 top
IC17  38.73,13.65 0 top
IC18  53.97,13.65 0 top
IC33  32.7,42.23 270 top
JP1  15.13,23.57 180 top
JP2  43.83,33.26 180 top
JP5  59.05,23.5 180 top
JP6  65.09,8.26 90 top
JP7  29.66,24.61 180 top
L1  4.76,24.77 180 top
LED1  50.8,32.38 180 top
Q1  59.37,32.7 180 top
Q2  50.8,37.78 0 top
Q3  43.5,38.1 0 top
R1  48.26,43.81 90 bottom
R2  54.29,43.5 90 bottom
R3  68.58,37.78 0 bottom
R4  55.88,37.78 0 bottom
R5  39.37,24.45 0 bottom
R6  39.37,20.95 180 bottom
R7  26.99,21.59 180 bottom
R8  33.97,29.84 180 bottom
R9  68.58,45.72 0 bottom
R10  68.58,41.59 180 bottom
R11  51.43,24.77 0 bottom
R12  2.54,10.48 90 bottom
R13  80.33,24.77 180 bottom
R14  76.84,37.78 90 bottom
R15  92.08,30.8 270 bottom
R16  86.04,30.8 180 bottom
R17  74.93,31.43 270 bottom
R18  79.69,30.8 0 bottom
R19  97.47,30.8 270 bottom
R20  97.47,37.47 90 bottom
R21  98.11,25.08 180 bottom
R22  102.87,30.8 0 bottom
R23  104.14,25.08 180 bottom
R24  108.9,29.84 90 bottom
R25  6.35,10.48 90 bottom
R26  10.16,10.48 90 bottom
R27  13.97,10.48 90 bottom
R28  17.78,10.48 90 bottom
R29  21.59,10.48 90 bottom
R30  25.4,10.48 90 bottom
R31  29.21,10.48 90 bottom
R32  33.02,10.48 90 bottom
R33  36.83,10.48 90 bottom
R34  40.64,10.48 90 bottom
R35  44.45,10.48 90 bottom
R36  48.26,10.48 90 bottom
R37  52.07,10.48 90 bottom
R38  58.74,6.03 180 bottom
R39  58.74,13.34 180 bottom
R40  58.74,3.81 180 top
R41  11.11,21.59 0 top
R42  20,21.91 0 bottom
R43  42.58,29.35 0 bottom
R44  32.7,21.59 0 bottom
R666  92.08,37.47 90 bottom
R999  87.95,25.08 180 bottom
SL1  51.43,44.13 270 top
SL2  57.78,44.13 270 top
SL3  80.65,45.4 0 top
SL4  98.11,45.4 0 top
SL5  44.77,44.13 270 top
SL9  13.02,4.45 0 top
SL10  29.85,4.45 0 top
SL11  47.62,4.13 0 top
T1  69.22,44.45 0 top
T2  62.86,44.77 0 top
X1  12.38,44.45 180 top

### Tracks (layer width: path | path; a pad name or v marks a point on that pad's centre or on a via)
9V  (via drill 0.61)
  Top 0.254: v13.65,26.35 13.65,28.57 IC5.OUT | v23.49,23.65 23.49,24.29 20,27.78 IC4.IN
  Bottom 0.254: v13.65,26.35 13.49,26.35 12.22,25.08 C20.1 | v23.49,23.65 R7.1 | IC5.OUT 13.65,29.84 IC4.IN
C13  (via drill 0.61)
  Top 0.254: v27.15,38.89 27.15,40.01 26.35,40.8 26.35,43.97 29.05,46.67 IC33.1
  Bottom 0.254: v27.15,38.89 29.21,36.83 C6.1
FET1  (via drill 0.61)
  Top 0.254: v69.21,21.75 69.37,21.91 69.37,26.04 69.53,26.19 69.53,28.73 IC1.2 | v98.9,14.29 101.44,14.29 102.08,13.65 105.73,13.65 106.68,14.61 IC12.2
  Bottom 0.254: v69.21,21.75 69.21,14.61 79.37,14.61 79.69,14.92 98.27,14.92 v98.9,14.29
FET2  (via drill 0.61)
  Top 0.254: v70.48,27.3 70.48,28.73 IC1.1 | v93.82,27.62 94.93,27.62 97.15,25.4 97.15,16.67 97.79,16.03 IC11.2
  Bottom 0.254: v70.48,27.3 78.42,27.3 78.58,27.46 93.66,27.46 v93.82,27.62
FET3  (via drill 0.61)
  Top 0.254: v72.07,28.26 72.07,27.3 IC1.32 | v74.45,28.26 74.45,27.94 80.65,21.75 80.65,19.37 81.6,18.41 83.03,18.41 83.66,17.78 v83.66,10.48 | v92.87,9.53 92.87,6.67 96.04,3.49 97,3.49 97.79,4.29 IC10.2
  Bottom 0.254: v74.45,28.26 v72.07,28.26 | v83.66,10.48 84.61,9.53 v92.87,9.53
FET4  (via drill 0.61)
  Top 0.254: v75.56,22.54 72.07,22.54 IC1.26 | v88.74,22.23 89.22,21.75 89.22,18.1 87.31,16.19 IC9.2
  Bottom 0.254: v75.56,22.54 84.45,22.54 84.77,22.23 v88.74,22.23
FET5  (via drill 0.61)
  Top 0.254: v76.36,21.59 72.07,21.59 IC1.25 | v91.12,13.02 91.12,9.21 87.31,5.4 IC8.2
  Bottom 0.254: v76.36,21.59 76.68,21.27 90.01,21.27 91.12,20.16 97.47,20.16 98.58,19.05 98.58,15.4 99.06,15.4 99.85,14.61 99.85,13.18 91.28,13.18 v91.12,13.02
FET6
  Top 0.254: IC1.24 70.48,20 70.8,20 71.6,19.21 77.95,19.21 78.1,19.37 78.1,21.75 78.26,21.91 79.22,21.91 79.37,21.75 79.37,16.35 78.74,15.72 IC7.2
FET7  (via drill 0.61)
  Top 0.254: v71.91,20.16 70.8,21.27 70.01,21.27 69.69,20.95 69.69,20.16 IC1.23 | v70.64,15.56 70.64,9.84 76.99,3.49 77.95,3.49 78.74,4.29 IC6.2
  Bottom 0.254: v71.91,20.16 71.91,15.56 v70.64,15.56
GND  (via drill 0.61)
  Top 0.254: C12.2 39.21,18.1 38.5,17.38 | 38.5,17.38 37.94,16.83 36.04,16.83 28.26,24.61 JP7.3 28.42,24.77 28.42,25.72 31.91,29.21 31.91,30 26.59,35.32 | C3.1 46.83,23.18 45.56,24.45 40,24.45 38.42,22.86 38.42,17.46 38.5,17.38 | X1.K X1.+ 16.99,34.45 21.35,30.08 | IC33.8 29.05,37.78 26.59,35.32 | 21.35,30.08 21.27,30 IC4.GND | 21.35,30.08 26.59,35.32 | 52.71,13.65 IC18.3 | 52.71,13.65 55.56,16.51 55.56,17.78 | 52.71,13.65 53.42,12.94 | 53.42,12.94 53.82,12.54 54.45,12.54 55.09,13.18 56.04,13.18 IC18.7 | 54.61,22.23 54.61,18.73 55.56,17.78 | 54.61,22.23 C4.1 54.61,33.66 58.42,37.47 59.37,37.47 61.12,35.72 63.82,35.72 | 55.56,17.78 C13.2 | 54.61,22.23 JP5.2 | IC16.3 22.23,13.65 22.3,13.73 | 22.3,13.73 22.38,13.81 22.38,14.45 22.07,14.76 21.91,14.76 | 21.91,14.76 21.43,14.76 IC16.1 21.91,14.76 | IC17.3 34.13,13.65 33.97,13.81 32.07,13.81 30.96,12.7 30.96,11.27 30.72,11.03 | 30.72,11.03 30.64,10.95 25.08,10.95 22.3,13.73 | 21.91,14.76 21.91,18.1 C11.2 v19.84,18.1 | IC5.GND 12.38,26.67 12.38,21.59 R41.2 | IC15.3 6.99,13.65 7.46,14.13 7.46,16.03 | 7.46,16.03 7.46,17.78 C10.2 | v8.1,16.03 7.46,16.03 | 53.42,12.94 51.43,10.95 30.8,10.95 30.72,11.03 | 85.57,32.7 85.57,23.97 87.31,22.23 IC9.7 | 85.57,32.7 85.57,34.29 | 85.57,34.29 85.57,37.15 C21.2 | 85.57,32.7 v85.41,32.7 | v104.3,18.41 104.78,18.41 106.68,20.32 IC12.7 106.68,23.34 105.73,24.29 104.78,24.29 | IC11.7 97.79,21.43 100.65,24.29 104.78,24.29 | 105.73,37.15 105.73,42.86 SL4.5 SL4.4 | 105.73,37.15 104.78,36.2 v104.78,32.7 104.78,24.29 | 105.73,37.15 C1.2 | 85.57,34.29 89.06,34.29 89.69,34.92 89.69,41.43 SL3.5 85.41,45.4 83.5,47.31 67.31,47.31 63.82,43.81 T2.E
  Top 0.254: v94.62,16.03 94.62,9.84 95.65,8.81 | 95.65,8.81 96.04,8.41 97,8.41 97.79,9.21 IC10.7 | IC8.7 87.31,8.41 86.36,7.46 v84.93,7.46 | v95.57,8.57 95.57,8.73 95.65,8.81 | T2.E 63.66,43.81 62.71,44.77 59.69,44.77 SL2.1 SL1.1 SL5.1 | IC33.10 36.51,39.05 v37.62,37.94 | 67.31,30.96 67.31,31.75 C5.1 67.47,32.07 63.82,35.72 | 67.31,30.96 67.31,28.89 IC1.5 | 67.31,30.96 68.18,30.08 | 68.18,30.08 68.74,29.53 68.74,28.89 IC1.3 68.9,28.73 68.9,22.7 68.1,21.91 68.1,20.16 IC1.21 68.1,20 68.1,19.37 68.74,18.73 70.17,18.73 71.44,17.46 C50.2 71.6,17.46 71.6,13.81 72.47,12.94 | v70.33,30.16 68.26,30.16 68.18,30.08 | IC6.7 78.74,9.21 77.95,8.41 76.99,8.41 76.6,8.81 | 72.47,12.94 76.6,8.81 | IC7.7 78.74,19.21 77.23,17.7 | 72.47,12.94 77.23,17.7 | 77.23,17.7 v76.68,18.26 | 63.82,35.72 63.82,43.66 T2.E | v76.52,8.57 76.52,8.73 76.6,8.81
  Bottom 0.254: R44.2 28.26,24.61 JP7.3 | 18.73,27.3 18.73,27.94 IC4.GND 21.91,28.57 33.97,28.57 35.24,29.84 R8.2 | 18.73,27.3 18.73,25.08 C2.2 | 33.02,18.26 29.21,18.26 | 33.02,18.26 36.83,18.26 | 33.02,18.26 C38.1 | 36.83,18.26 38.1,18.26 | 38.1,18.26 40.64,18.26 | 36.83,18.26 C37.1 | 40.64,18.26 44.45,18.26 | 40.64,18.26 C36.1 | 44.45,18.26 48.26,18.26 | 44.45,18.26 C35.1 | 48.26,18.26 52.07,18.26 C41.1 | 48.26,18.26 C42.1 | 38.1,18.26 38.1,20.95 R6.1 | 9.52,25.08 IC5.GND 18.73,27.3 | C19.2 4.45,25.56 4.92,25.08 C20.2 9.52,25.08 | 6.35,18.26 2.54,18.26 C26.1 | 6.35,18.26 8.1,18.26 | 8.1,18.26 9.52,18.26 | 9.52,18.26 10.16,18.26 | 6.35,18.26 C25.1 | 10.16,18.26 13.97,18.26 | 10.16,18.26 C24.1 9.52,18.26 | 13.97,18.26 17.78,18.26 | 13.97,18.26 C23.1 | 17.78,18.26 19.84,18.26 | 19.84,18.26 21.59,18.26 | 17.78,18.26 C32.1 | 21.59,18.26 25.4,18.26 | 21.59,18.26 C31.1 | 8.1,18.26 v8.1,16.03 | 9.52,18.26 9.52,25.08 | 19.84,18.26 v19.84,18.1 | 29.21,18.26 28.1,19.37 26.51,19.37 25.4,18.26 | 29.21,18.26 C29.1 | 25.4,18.26 C30.1 | IC13.11 83.82,32.7 v85.41,32.7 | SL3.5 90.81,45.4 92.71,47.31 98.74,47.31 SL4.4 | v104.3,18.41 C45.2 | v104.78,32.7 IC14.11 | IC14.5 106.04,43.97 104.62,43.97 SL4.5 | 60.17,6.99 R38.2 | 60.17,6.99 60.17,9.53 | 60.17,9.53 R39.2 | 60.17,9.53 C22.2 | 60.17,6.99 JP6.6 64.93,5.87 79.37,5.87 79.45,5.95 | v94.62,16.03 97,18.41 C44.2 | 79.45,5.95 79.53,5.87 83.82,5.87 85.17,7.22 | 79.45,5.95 78.1,7.3 C17.2 77.95,7.3 76.68,8.57 v76.52,8.57 | 85.17,7.22 85.25,7.3 C16.2 86.68,7.3 87.95,8.57 v95.57,8.57 95.73,8.57 97,7.3 C18.2 | 85.17,7.22 v84.93,7.46 | 37.23,38.18 42.86,43.81 42.86,46.67 SL5.1 | 37.23,38.18 35.88,36.83 C9.1 | v37.62,37.94 37.46,38.1 37.31,38.1 37.23,38.18
  Bottom 0.254: v70.33,30.16 66.83,26.67 C51.1 | C14.2 85.25,18.1 83.98,19.37 79.69,19.37 78.42,18.1 C15.2 78.26,18.1 78.1,18.26 v76.68,18.26
  pour Top: 0.64,48.26 110.49,48.26 110.49,0.64 0.64,0.64
  pour Bottom: 0.64,48.26 110.49,48.26 110.49,0.32 0.64,0.32
GON  (via drill 0.61)
  Top 0.254: v64.93,24.45 64.61,24.77 63.34,24.77 IC1.12 | v55.88,25.72 55.88,33.66 v58.74,36.51 | v61.44,36.67 62.86,38.1 v62.86,41.12
  Bottom 0.254: v64.93,24.45 63.98,23.5 58.1,23.5 v55.88,25.72 | v58.74,36.51 58.9,36.67 v61.44,36.67 | v62.86,41.12 63.34,41.59 R10.1
I1N
  Bottom 0.254: R37.1 52.07,5.71 51.75,5.71 SL11.4
I1P
  Bottom 0.254: R36.1 48.26,4.13 SL11.3
I2N
  Bottom 0.254: R35.1 44.45,4.13 SL11.2
I2P
  Bottom 0.254: R34.1 40.64,4.13 SL11.1
I3N
  Bottom 0.254: R33.1 36.83,4.45 SL10.5
I3P
  Bottom 0.254: R32.1 33.02,4.45 SL10.4
I4N
  Bottom 0.254: R31.1 29.21,4.45 SL10.3
I4P
  Bottom 0.254: R30.1 25.4,6.03 25.72,6.03 SL10.2
I5N
  Bottom 0.254: R29.1 21.59,4.45 SL10.1
I5P
  Bottom 0.254: R28.1 17.78,4.45 SL9.5
I6N
  Bottom 0.254: R27.1 13.97,5.71 14.29,5.71 SL9.4
I6P
  Bottom 0.254: SL9.3 13.02,6.19 10.16,9.05 R26.1
I7N
  Bottom 0.254: SL9.2 10.48,4.92 6.35,9.05 R25.1
I7P
  Bottom 0.254: SL9.1 7.14,4.45 2.54,9.05 R12.1
LDAC  (via drill 0.61)
  Top 0.254: v104.3,20.95 100.33,20.95 IC11.5 | v108.11,22.54 109.22,21.43 IC12.5 | IC8.5 v89.85,11.43 89.85,13.18 90.49,13.81 90.49,19.84 89.85,20.48 IC9.5 89.85,20.8 v90.81,21.75 | v100.33,11.43 IC10.5 | v67.95,23.34 64.14,27.15 63.34,27.15 IC1.9 | IC7.5 81.28,20.48 81.44,20.32 v82.39,20.32 84.14,18.57 84.14,15.08 86.68,12.54 v86.68,11.43 86.68,8.57 86.52,8.41 84.45,8.41 83.18,9.68 81.28,9.68 IC6.5
  Bottom 0.254: v108.11,22.54 105.89,22.54 v104.3,20.95 104.3,21.11 103.66,21.75 v90.81,21.75 | v100.33,11.43 v89.85,11.43 v86.68,11.43 | v67.95,23.34 68.1,23.18 73.5,23.18 76.36,20.32 v82.39,20.32
N$1  (via drill 0.61)
  Top 0.254: 4.21,14.05 3.02,15.24 2.54,15.24 C27.1 | 4.21,14.05 5.08,13.18 6.03,13.18 IC15.4 | v4.13,13.97 4.21,14.05
  Bottom 0.254: R12.2 2.54,13.97 | 2.54,13.97 C26.2 | v4.13,13.97 2.54,13.97
N$2  (via drill 0.61)
  Top 0.254: v91.76,22.7 91.76,13.65 92.07,13.34 v92.07,10.48 | v84.93,10.48 85.41,10.48 86.04,9.84 IC8.8
  Bottom 0.254: v91.76,22.7 R999.2 | v84.93,10.48 v92.07,10.48
N$3  (via drill 0.61)
  Top 0.254: v31.43,41.27 30,41.27 29.69,41.59 IC33.5
  Bottom 0.254: v31.43,41.27 33.18,41.27 35.56,43.66 C7.2
N$4  (via drill 0.61)
  Top 0.254: 67.23,17.86 67.63,17.46 C50.1 | 67.23,17.86 65.72,19.37 65.72,20 IC1.18 65.56,20.16 v65.56,21.59 | 67.23,17.86 v65.88,16.51 | IC1.4 67.95,28.73 67.95,27.94 67.63,27.62 66.83,27.62 66.52,27.94 66.52,28.73 IC1.6 66.36,28.89 v66.36,30.16 | v57.15,23.18 57.15,25.4 v59.69,27.94
  Bottom 0.254: JP6.2 60.96,4.76 59.21,4.76 58.9,5.08 58.9,16.51 v65.88,16.51 | 64.14,27.94 64.14,26.67 C51.2 | v66.36,30.16 64.14,27.94 | 59.77,28.02 59.85,27.94 64.14,27.94 | 59.77,28.02 58.42,29.37 54.29,29.37 53.02,28.1 40.16,28.1 39.85,28.42 35.88,28.42 35.56,28.1 28.42,28.1 27.15,26.83 20.16,26.83 20.16,24.45 19.53,23.81 16.67,23.81 15.24,22.38 JP1.2 | v65.56,21.59 60.64,21.59 60.17,21.11 57.94,21.11 57.15,21.91 v57.15,23.18 | v59.69,27.94 59.77,28.02
N$5
  Top 0.254: Q2.2 49.85,36.99 49.85,37.31 51.43,38.89 SL1.3 SL2.3
  Bottom 0.254: SL1.3 51.43,40.64 49.85,39.05 46.83,39.05 46.83,43.66 48.26,45.09 R1.2
N$6  (via drill 0.61)
  Top 0.254: v68.42,33.34 73.03,28.73 73.03,26.83 72.71,26.51 72.07,26.51 IC1.31 | v47.94,34.13 46.99,35.08 45.88,35.08 44.93,34.13 44.93,32.07 44.29,31.43 43.34,31.43 42.39,32.38 42.39,34.45 40.72,36.12 | 40.72,36.12 36.51,40.32 IC33.11 | v36.04,31.59 30.96,26.51 30.96,24.77 JP7.2 | 40.72,36.12 v38.74,34.13
  Bottom 0.254: v68.42,33.34 68.26,33.5 63.02,33.5 62.23,34.29 48.1,34.29 v47.94,34.13 | v36.04,31.59 38.58,34.13 v38.74,34.13
N$7
  Top 0.254: X1.-1 7.3,44.45 7.3,30.8 4.76,28.26 L1.1
N$8  (via drill 0.61)
  Top 0.254: 19.45,14.05 18.26,15.24 17.78,15.24 C33.2 | 19.45,14.05 20.32,13.18 21.27,13.18 IC16.4 | v19.37,13.97 19.45,14.05
  Bottom 0.254: R28.2 17.78,13.97 | 17.78,13.97 C32.2 | v19.37,13.97 17.78,13.97
N$9
  Top 0.254: IC33.13 41.28,42.86 43.66,40.48 45.88,40.48 46.67,41.27 46.67,42.23 SL5.2
N$11  (via drill 0.61)
  Top 0.254: v63.82,28.89 64.77,28.89 IC1.8
  Bottom 0.254: 63.82,31.11 63.82,32.7 Q1.1 | 63.82,31.11 v63.82,28.89 | C5.2 67.95,34.29 68.74,34.29 69.37,33.66 69.37,30.96 66.68,30.96 66.52,31.11 63.82,31.11
N$12
  Top 0.254: D1.A 2.54,32.86 1.27,31.59 1.27,24.92 4.76,21.43 L1.2
N$13  (via drill 0.61)
  Top 0.254: v27.94,42.23 28.42,42.23 29.05,42.86 IC33.4
  Bottom 0.254: v27.94,42.23 32.54,42.23 32.54,43.34 35.56,46.35 C7.1
N$14  (via drill 0.61)
  Top 0.254: v27.78,43.97 29.37,43.97 29.53,44.13 IC33.3
  Bottom 0.254: v27.78,43.97 26.83,43.97 26.83,41.91 29.21,39.53 C6.2
N$15
  Top 0.254: JP6.1 65.25,3.02 63.66,3.02 62.71,3.97 62.71,12.54 63.34,13.18 63.98,13.18 64.93,14.13 64.93,15.08 62.86,17.14 62.86,20.95 63.18,21.27 63.18,21.59 IC1.16
N$16  (via drill 0.61)
  Top 0.254: v31.43,45.09 30,45.09 29.69,45.4 IC33.2
  Bottom 0.254: v31.43,45.09 30.8,45.09 29.85,46.04 C8.1
N$17  (via drill 0.61)
  Top 0.254: v31.43,39.53 31.12,39.53 30.32,40.32 IC33.6
  Bottom 0.254: v31.43,39.53 35.88,39.53 C9.2
N$18  (via drill 0.61)
  Top 0.254: v70.33,24.45 70.64,24.77 71.91,24.77 IC1.29 | v68.1,14.29 68.1,4.6 66.83,3.33 65.88,3.33 65.25,3.97 65.25,5.87 JP6.5
  Bottom 0.254: v70.33,24.45 70.17,24.29 67.63,24.29 66.99,23.65 66.99,22.54 67.47,22.54 68.1,21.91 v68.1,14.29
N$19
  Top 0.254: 59.21,30.32 64.77,30.32 65.56,29.53 65.56,28.89 IC1.7 | C4.2 59.21,30.32 | 59.21,30.32 Q1.2
N$20  (via drill 0.61)
  Top 0.254: IC12.8 v105.41,23.34
  Bottom 0.254: v105.41,23.34 105.41,25.08 R23.2
N$21  (via drill 0.61)
  Top 0.254: v90.17,29.69 92.23,27.62 92.23,23.5 92.71,23.02 v92.71,16.19 | v76.36,15.56 76.36,10.95 77.47,9.84 IC6.8
  Bottom 0.254: v90.17,29.69 89.69,29.21 75.72,29.21 R17.2 | v92.71,16.19 92.07,15.56 v76.36,15.56
N$22
  Top 0.254: SL1.2 49.53,42.23 49.53,41.59 45.24,37.31 42.54,37.31 Q3.2
  Bottom 0.254: SL1.2 53.66,44.13 54.29,44.77 R2.2 54.29,44.61 57.31,44.61 SL2.2
N$23  (via drill 0.61)
  Top 0.254: v61.91,15.4 61.91,21.75 62.55,22.38 63.18,22.38 IC1.15 | JP6.4 63.82,5.4 64.93,6.51 64.93,10.95 JP6.10
  Bottom 0.254: v61.91,15.4 61.91,12.54 63.34,12.54 JP6.10
N$26  (via drill 0.61)
  Top 0.254: v94.62,26.67 94.62,26.19 96.52,24.29 IC11.8
  Bottom 0.254: v94.62,26.67 94.77,26.67 R19.2
N$27
  Top 0.254: R40.2 53.02,3.81 SL11.5
N$29  (via drill 0.61)
  Top 0.254: 19.84,12.54 17.78,12.54 C33.1 | 19.84,12.54 21.27,12.54 IC16.5 | v19.84,12.38 19.84,12.54
  Bottom 0.254: 21.59,12.38 R29.2 | 21.59,12.38 C31.2 | 21.59,12.38 v19.84,12.38
N$30  (via drill 0.61)
  Top 0.254: IC16.6 25.72,12.54 v27.15,12.54 29.21,12.54 C34.2
  Bottom 0.254: 25.4,12.54 R30.2 | 25.4,12.54 C30.2 | 25.4,12.54 v27.15,12.54
N$31  (via drill 0.61)
  Top 0.254: IC7.8 v77.47,23.5
  Bottom 0.254: v77.47,23.5 80.33,23.5 81.6,24.77 R13.2
N$32  (via drill 0.61)
  Top 0.254: 30.48,13.97 30.48,11.59 30.32,11.43 25.56,11.43 24.61,12.38 24.61,13.02 24.76,13.18 25.56,13.18 IC16.7 | 30.48,13.97 29.21,15.24 C34.1 | 30.48,13.97 v30.64,13.97
  Bottom 0.254: R31.2 29.21,13.97 | 29.21,13.97 C29.2 | v30.64,13.97 29.21,13.97
N$33
  Top 0.254: IC33.14 42.23,44.13 SL5.3
N$35  (via drill 0.61)
  Top 0.254: v70.01,35.08 73.5,31.59 73.5,24.13 72.71,23.34 72.07,23.34 IC1.27 | Q2.3 57.94,37.78 58.1,37.94 v61.44,37.94
  Bottom 0.254: v70.01,35.08 67.31,37.78 R3.2 67.15,37.78 66.99,37.94 v61.44,37.94
N$36
  Bottom 0.254: 79.77,31.99 80.96,30.8 R18.1 | 79.77,31.99 79.69,32.07 75.56,32.07 74.93,32.7 R17.1 | IC13.13 81.28,32.07 79.85,32.07 79.77,31.99
N$37  (via drill 0.61)
  Top 0.254: v61.91,24.45 61.91,23.97 62.55,23.34 63.18,23.34 IC1.14
  Bottom 0.254: v61.91,24.45 61.6,24.77 JP5.1
N$38  (via drill 0.61)
  Top 0.254: v84.61,26.51 84.61,28.57 v83.03,30.16
  Bottom 0.254: v84.61,26.51 85.09,26.51 R999.1 | v83.03,30.16 83.66,30.8 R16.1 84.77,30.8 85.88,31.91 86.36,31.91 IC13.9
N$40
  Bottom 0.254: R21.1 96.84,25.08 101.28,29.53 102.87,29.53 104.14,30.8 R22.1 103.82,30.64 102.39,32.07 102.23,32.07 IC14.13
N$41  (via drill 0.61)
  Top 0.254: v94.46,22.7 94.46,20.48 93.5,19.53 93.5,18.57 95.89,16.19 95.89,10.48 96.52,9.84 IC10.8
  Bottom 0.254: v94.46,22.7 97,22.7 99.38,25.08 R21.2
N$42  (via drill 0.61)
  Top 0.254: v70.33,25.72 71.91,25.72 IC1.30 | JP7.1 33.5,24.77 v36.2,27.46 36.99,28.26 36.99,31.91 34.29,34.61 34.29,40.8 35.08,41.59 IC33.12
  Bottom 0.254: v70.33,25.72 70.01,25.4 60.64,25.4 58.9,27.15 50.64,27.15 50.32,27.46 v36.2,27.46
N$43  (via drill 0.61)
  Top 0.254: LED1.3 50.8,27.3 v50.01,26.51
  Bottom 0.254: v50.01,26.51 R11.2
N$45  (via drill 0.61)
  Top 0.254: 34.77,13.18 33.5,13.18 33.02,12.7 C39.2 | 34.77,13.18 36.51,13.18 IC17.4 | 34.77,13.18 v34.77,12.7
  Bottom 0.254: R32.2 33.02,12.7 | 33.02,12.7 C38.2 | v34.77,12.7 33.02,12.7
N$46
  Top 0.254: IC1.17 64.93,20 64.93,16.03 JP6.11 67.47,13.49 67.47,6.51 66.36,5.4 JP6.3
N$48  (via drill 0.61)
  Top 0.254: v38.58,12.54 36.67,12.54 IC17.5 | v35.08,15.4 33.02,15.4 C39.1
  Bottom 0.254: v38.58,12.54 37.94,11.91 R33.2 | 36.83,15.4 v35.08,15.4 | 36.83,15.4 R33.2 | R33.2 | 36.83,15.4 C37.2
N$49  (via drill 0.61)
  Top 0.254: 42.62,11.99 43.18,11.43 45.56,11.43 45.72,11.59 45.72,13.97 44.45,15.24 C40.2 | 42.62,11.99 42.07,12.54 40.96,12.54 IC17.6 | v42.54,11.91 42.62,11.99
  Bottom 0.254: R34.2 C36.2 | v42.54,11.91 R34.2 | R34.2
N$50  (via drill 0.61)
  Top 0.254: v70.48,22.23 70.48,23.34 71.12,23.97 71.91,23.97 IC1.28 | v94.46,19.21 94.46,19.68 95.41,20.64 95.41,24.61 92.71,27.3 92.71,40.64 87.15,46.2 v87.15,46.35 | v45.56,39.05 44.61,38.1 Q3.3
  Bottom 0.254: v70.48,22.23 71.6,21.11 72.55,21.11 77.15,16.51 91.76,16.51 v94.46,19.21 | v87.15,46.35 86.2,47.31 73.82,47.31 69.37,42.86 61.28,42.86 57.47,39.05 55.88,39.05 54.61,37.78 R4.2 46.83,37.78 v45.56,39.05
N$51  (via drill 0.61)
  Top 0.254: v42.23,25.88 46.35,30 46.35,33.18 JP2.1
  Bottom 0.254: R5.1 R6.2 | R5.1 v42.23,25.88 | R5.1
N$52  (via drill 0.61)
  Top 0.254: v90.17,28.42 90.17,26.04 v87.47,23.34 | v85.09,23.18 85.09,21.59 86.04,20.64 IC9.8
  Bottom 0.254: v90.17,28.42 91.12,28.42 R15.2 | v87.47,23.34 87.31,23.18 v85.09,23.18
N$54  (via drill 0.61)
  Top 0.254: v63.82,20.64 64.45,21.27 64.45,23.65 64.14,23.97 63.34,23.97 IC1.13
  Bottom 0.254: v63.82,20.64 56.99,20.64 R11.1
N$56  (via drill 0.61)
  Top 0.254: v64.77,36.99 70.01,42.23 70.01,43.34 T1.E
  Bottom 0.254: 4.45,29.37 4.45,31.11 D1.C | 4.45,29.37 C19.1 | v64.77,36.99 63.34,35.56 27.15,35.56 22.54,30.96 12.22,30.96 IC5.IN 10.48,29.37 4.45,29.37
N$57
  Bottom 0.254: R19.1 R20.1 97.47,36.2 102.23,36.2 IC14.2
N$58
  Bottom 0.254: 107.31,28.42 R24.1 | 107.31,28.42 106.2,28.42 102.87,25.08 R23.1 | 107.31,28.42 IC14.9
N$59  (via drill 0.61)
  Top 0.254: 80.41,38.34 81.6,37.15 C21.1 | 80.41,38.34 73.34,45.4 69.21,45.4 T1.C | v103.66,41.59 103.19,41.12 103.19,37.15 C1.1 | v83.66,41.59 80.41,38.34
  Bottom 0.254: IC14.4 104.78,40.48 v103.66,41.59 103.51,41.75 83.82,41.75 83.82,41.59 | 83.82,41.59 IC13.4 | 83.82,41.59 v83.66,41.59
N$60  (via drill 0.61)
  Top 0.254: v67.15,21.59 67.15,20.16 IC1.20 | v46.35,21.59 44.77,23.18 C3.2
  Bottom 0.254: v67.15,21.59 62.86,17.3 55.24,17.3 52.86,19.68 48.26,19.68 v46.35,21.59
N$61  (via drill 0.61)
  Top 0.254: v66.99,43.97 67.47,43.5 68.26,43.5 T1.B
  Bottom 0.254: v66.99,43.97 66.99,45.72 R9.2
N$62  (via drill 0.61)
  Top 0.254: Q3.1 42.39,38.89 42.39,38.58 41.43,37.62 41.43,36.2 43.82,33.81 43.82,33.34 JP2.2 43.82,33.97 48.42,38.58 49.53,38.58 | 49.53,38.58 49.69,38.58 Q2.1 49.53,38.58 | 49.53,38.58 v49.53,40.01
  Bottom 0.254: 49.53,42.7 53.82,42.7 54.29,42.23 R2.1 | 49.53,42.7 48.42,42.7 48.26,42.55 R1.1 | v49.53,40.01 49.53,42.7
N$63  (via drill 0.61)
  Top 0.254: v64.61,45.88 T2.C
  Bottom 0.254: v64.61,45.88 65.72,46.99 68.58,46.99 69.85,45.72 R9.1
N$64  (via drill 0.61)
  Top 0.254: v61.91,40.32 61.91,43.66 T2.B
  Bottom 0.254: v61.91,40.32 62.07,40.16 68.42,40.16 69.85,41.59 R10.2
N$70  (via drill 0.61)
  Top 0.254: 11.99,12.3 12.86,11.43 15.08,11.43 15.24,11.59 15.24,13.97 13.97,15.24 C28.1 | 11.99,12.3 11.75,12.54 10.48,12.54 IC15.6 | v11.91,12.22 11.99,12.3
  Bottom 0.254: 10.16,12.22 R26.2 | 10.16,12.22 C24.2 | v11.91,12.22 10.16,12.22
N$71  (via drill 0.61)
  Top 0.254: 4.6,12.54 2.54,12.54 C27.2 | 4.6,12.54 6.03,12.54 IC15.5 | v4.6,12.38 4.6,12.54
  Bottom 0.254: 6.35,12.38 R25.2 | 6.35,12.38 C25.2 | 6.35,12.38 v4.6,12.38
N$72  (via drill 0.61)
  Top 0.254: IC17.7 40.96,13.18 v42.7,13.18 43.97,13.18 44.45,12.7 C40.1
  Bottom 0.254: R35.2 44.45,13.18 | 44.45,13.18 C35.2 | v42.7,13.18 44.45,13.18
N$73
  Bottom 0.254: R15.1 R666.1 92.07,36.2 86.36,36.2 IC13.6
N$74  (via drill 0.61)
  Top 0.254: 12.54,13.18 13.49,13.18 13.97,12.7 C28.2 | 12.54,13.18 10.48,13.18 IC15.7 | v12.54,13.97 12.54,13.18
  Bottom 0.254: R27.2 16.51,11.91 16.51,13.97 15.87,14.61 14.76,14.61 13.97,15.4 C23.2 13.97,15.24 13.81,15.24 v12.54,13.97
N$76  (via drill 0.61)
  Top 0.254: 49.93,14.05 48.74,15.24 48.26,15.24 C43.2 | 49.93,14.05 50.8,13.18 51.75,13.18 IC18.4 | v49.85,13.97 49.93,14.05
  Bottom 0.254: R36.2 48.26,13.97 | 48.26,13.97 C42.2 | v49.85,13.97 48.26,13.97
N$78  (via drill 0.61)
  Top 0.254: 50.32,12.54 48.26,12.54 C43.1 | 50.32,12.54 51.75,12.54 IC18.5 | v50.32,12.38 50.32,12.54
  Bottom 0.254: 52.07,12.38 R37.2 | 52.07,12.38 C41.2 | 52.07,12.38 v50.32,12.38
N$91  (via drill 0.61)
  Top 0.254: v78.9,35.4 v78.9,26.51
  Bottom 0.254: v78.9,26.51 R13.1 | R14.1 77.95,36.35 v78.9,35.4 78.74,35.72 80.33,37.31 81.28,37.31 IC13.2
N$96
  Bottom 0.254: IC14.6 107.31,39.69 108.59,39.69 IC14.7
SCK  (via drill 0.61)
  Top 0.254: v80.01,13.97 IC7.3 | v88.58,13.97 IC9.3 | IC10.3 99.06,6.19 100.89,8.02 | 105.65,12.78 107.95,15.08 IC12.3 | 105.65,12.78 100.89,8.02 | IC11.3 99.06,16.51 99.85,17.3 101.28,17.3 v103.51,15.08 | v105.89,12.7 105.73,12.7 105.65,12.78 | 100.89,8.02 100.96,7.94 100.96,3.65 99.06,1.75 90.96,1.75 88.58,4.13 IC8.3 88.58,4.29 87.79,3.49 80.8,3.49 80.01,4.29 IC6.3 80.01,4.13 78.9,3.02 76.68,3.02 69.69,10 v69.69,13.02
  Bottom 0.254: 69.69,13.34 65.09,13.34 JP6.12 | 69.69,13.34 79.37,13.34 v80.01,13.97 v88.58,13.97 | v105.89,12.7 v103.51,15.08 | v69.69,13.02 69.69,13.34
SCL2  (via drill 0.61)
  Top 0.254: IC1.11 63.18,25.56 61.75,25.56 60.96,24.77 60.96,21.75 56.83,17.62 56.83,15.4 56.2,14.76 IC18.10 56.04,14.76 55.4,14.76 v54.13,13.49 | 29.85,16.51 35.24,16.51 36.51,15.24 36.51,14.76 IC17.1 36.67,14.76 40.48,14.76 | 29.85,16.51 28.1,16.51 26.35,14.76 25.72,14.76 IC16.10 | 40.48,14.76 40.8,14.76 IC17.10 40.48,14.76 | IC15.10 10.32,14.76 10.32,15.56 9.05,16.83 9.05,20.95 R41.1 9.84,21.59 v11.11,20.32 | 29.85,16.51 29.85,20.16 29.21,20.8 27.46,20.8 v26.99,20.32 | 40.48,14.76 v42.39,16.67
  Bottom 0.254: 17.07,20.4 16.99,20.32 v11.11,20.32 | 17.07,20.4 R42.2 | v26.99,20.32 17.14,20.32 17.07,20.4 | v54.13,13.49 54.13,10.64 47.31,10.64 45.72,12.22 45.72,16.67 v42.39,16.67
SDA2  (via drill 0.61)
  Top 0.254: v59.69,29.37 62.55,26.51 63.18,26.51 IC1.10 | 24.53,15 24.61,14.92 24.61,14.29 24.76,14.13 25.56,14.13 IC16.9 | 24.53,15 23.34,16.19 23.34,18.73 22.7,19.37 19.84,19.37 17.3,16.83 12.22,16.83 11.27,15.88 11.27,15.24 11.59,14.92 11.59,14.45 11.27,14.13 10.48,14.13 IC15.9 | 43.34,16.51 43.18,16.35 43.18,15.56 41.75,14.13 40.96,14.13 IC17.9 | 43.34,16.51 49.85,16.51 51.2,15.16 | 51.2,15.16 51.59,14.76 51.75,14.76 IC18.1 53.18,16.03 v53.82,16.03 | v57.78,16.03 57.78,14.92 56.99,14.13 56.2,14.13 IC18.9 | v39.37,22.54 43.34,18.57 43.34,16.51 | 24.53,15 26.99,17.46 27.46,17.46 28.89,18.89 v28.89,19.84 | v48.74,32.38 49.05,32.38 49.69,31.75 49.69,27.46 49.05,26.83 49.05,19.84 51.28,17.62 51.28,15.24 51.2,15.16
  Bottom 0.254: v59.69,29.37 57.94,31.11 52.86,31.11 52.39,31.59 48.74,31.59 | 48.74,31.59 46.99,31.59 46.83,31.43 43.34,31.43 43.02,31.75 42.39,31.75 41.28,30.64 41.28,29.37 R43.2 | v53.82,16.03 v57.78,16.03 | v39.37,22.54 35.08,22.54 R44.1 33.97,21.59 32.7,20.32 29.37,20.32 v28.89,19.84 | v48.74,32.38 48.74,31.59
SDI  (via drill 0.61)
  Top 0.254: v84.14,4.76 81.28,4.76 IC6.4 | IC8.4 89.85,4.76 v90.96,4.76 93.5,2.22 98.27,2.22 100.33,4.29 IC10.4 | 102.31,15 103.19,14.13 105.41,14.13 106.04,14.76 106.04,17.14 106.2,17.3 108.43,17.3 109.22,16.51 IC12.4 | 102.31,15 101.44,15.88 100.33,15.88 IC11.4 | IC7.4 81.28,13.97 v79.53,12.22 | IC9.4 89.85,13.97 v88.58,12.7 | v102.23,14.76 102.23,14.92 102.31,15
  Bottom 0.254: v84.14,4.76 v90.96,4.76 91.28,5.08 101.44,5.08 103.35,6.99 103.35,12.38 100.01,12.38 99.93,12.46 | JP6.9 79.37,12.06 v79.53,12.22 79.69,12.38 88.26,12.38 v88.58,12.7 88.58,12.54 90.01,12.54 90.49,12.06 99.54,12.06 99.93,12.46 | 99.93,12.46 v102.23,14.76
SFET1
  Bottom 0.254: R24.2 108.9,34.45 108.59,34.45 IC14.8 108.59,35.24 107.31,36.51 105.41,36.51 105.41,41.12 103.98,42.55 100.96,42.55 SL4.3
SFET2  (via drill 0.61)
  Top 0.254: v95.57,40.32 SL4.2
  Bottom 0.254: IC14.1 100.96,39.69 98.27,39.69 R20.2 97.47,39.05 96.84,39.05 v95.57,40.32
SFET3  (via drill 0.61)
  Top 0.254: SL4.1 93.03,41.59 v99.85,34.77
  Bottom 0.254: R22.2 101.44,34.45 100.96,34.45 IC14.14 100.96,34.61 100.01,34.61 v99.85,34.77
SFET4  (via drill 0.61)
  Top 0.254: v88.74,39.85 SL3.4
  Bottom 0.254: 88.74,39.69 87.63,39.69 IC13.7 | 88.74,39.69 91.28,39.69 R666.2 | 88.74,39.69 v88.74,39.85
SFET5  (via drill 0.61)
  Top 0.254: SL3.3 80.96,45.4 83.82,42.55 83.98,42.55 88.74,37.78 v88.74,35.24
  Bottom 0.254: R16.2 87.47,34.45 87.63,34.45 IC13.8 87.63,34.61 88.11,34.61 v88.74,35.24
SFET6
  Bottom 0.254: 78.1,39.69 80.01,39.69 IC13.1 | 78.1,39.69 77.31,39.69 R14.2 | 78.1,39.69 SL3.2
SFET7
  Bottom 0.254: 75.56,34.45 80.01,34.45 IC13.14 | 75.56,34.45 73.66,34.45 73.66,31.91 73.98,31.59 77.47,31.59 R18.2 | 75.56,34.45 SL3.1
U  (via drill 0.61)
  Top 0.254: 56.75,7.06 60.01,3.81 R40.1 | 56.75,7.06 56.2,7.62 56.2,12.54 IC18.6 | 56.75,7.06 v57.47,7.78
  Bottom 0.254: 57.47,9.53 v57.47,7.78 57.47,6.03 R38.1 | 57.47,9.53 57.47,13.34 R39.1 | 57.47,9.53 C22.1
VDD  (via drill 0.61)
  Top 0.254: 105.41,17.46 105.41,17.78 107.95,20.32 IC12.6 | 105.41,17.46 IC12.1 | IC11.6 99.06,20.32 100.49,18.89 | 100.49,18.89 101.92,17.46 105.41,17.46 | 100.49,18.89 v101.28,19.68 | 96.52,6.03 96.52,6.67 99.06,9.21 IC10.6 99.06,10.32 96.76,12.62 | 96.52,6.03 IC10.1 | IC11.1 96.52,12.86 96.76,12.62 | 96.52,6.03 v95.57,6.03 | v104.14,12.7 96.84,12.7 96.76,12.62 | 85.17,16.59 86.04,15.72 IC9.1 86.04,13.97 88.58,11.43 IC8.6 88.58,8.89 86.04,6.35 86.04,6.19 | 85.17,16.59 84.93,16.83 v84.93,19.68 84.45,19.68 73.98,30.16 73.98,33.81 v72.71,35.08 | IC9.6 88.58,20 85.17,16.59 | 86.04,6.19 IC8.1 | 81.92,17.46 81.76,17.46 80.01,19.21 IC7.6 | 81.92,17.46 v82.71,17.46 | 77.47,6.19 77.47,6.67 80.01,9.21 IC6.6 80.01,10.32 79.45,10.87 | 77.47,6.19 IC6.1 | IC7.1 77.47,12.86 79.45,10.87 | 81.92,17.46 81.92,13.34 79.45,10.87 | 77.47,6.19 82.39,6.19 | 82.39,6.19 84.93,6.19 | 84.93,6.19 86.04,6.19 | IC18.8 59.69,13.65 v61.75,11.59 | v82.39,6.83 82.39,6.19 | 84.93,6.19 v84.93,5.71 | 51.75,32.38 v51.75,29.21 51.75,18.89 52.86,17.78 C13.1 | 51.75,32.38 51.75,33.34 LED1.1 | 51.75,32.38 v55.88,36.51 | IC15.8 8.41,13.65 6.19,11.43 1.43,11.43 1.27,11.59 1.27,16.35 1.43,16.51 4.29,16.51 4.37,16.43 | 4.37,16.43 6.03,14.76 IC15.1 | C10.1 12.86,17.78 16.91,21.83 | 16.91,21.83 16.99,21.91 16.99,23.02 15.24,24.77 JP1.1 15.08,24.92 15.08,28.57 13.33,30.32 12.7,30.32 11.91,29.53 11.91,29.21 8.41,25.72 8.41,21.11 4.45,17.14 4.45,16.51 4.37,16.43 | 37.15,26.04 37.15,26.83 41.2,30.88 | 37.15,26.04 37.15,18.1 C12.1 | 41.2,30.88 41.28,30.96 41.28,33.18 JP2.3 | v42.7,30.8 41.28,30.8 41.2,30.88 | IC16.8 26.51,13.65 v27.15,14.29 | 25.88,18.41 24.92,18.41 24.61,18.1 C11.1
  Top 0.254: 25.88,18.41 v27.15,18.41 | v39.37,13.65 IC17.8 | 32.39,43.66 32.7,43.66 35.08,46.04 | 32.39,43.66 v31.75,43.66 | 35.08,46.04 35.72,46.67 IC33.16 | 35.08,46.04 35.72,45.4 IC33.15 | IC4.OUT 22.54,27.94 25.72,24.77 JP7.4 25.88,24.61 25.88,21.75 | v32.39,34.61 32.39,43.66 | 25.88,21.75 25.88,18.41 | v36.83,26.04 37.15,26.04 | 25.88,21.75 16.99,21.75 16.91,21.83
  Bottom 0.254: C44.1 99.85,18.41 101.12,19.68 v101.28,19.68 107.31,19.68 108.59,18.41 C45.1 108.43,18.41 108.43,11.75 105.09,11.75 v104.14,12.7 | C18.1 99.7,7.3 98.43,6.03 v95.57,6.03 90.65,6.03 89.38,7.3 C16.1 89.22,7.3 87.63,5.71 v84.93,5.71 | v84.93,19.68 87.95,19.68 89.54,18.1 C14.1 | v82.71,17.46 81.76,17.46 81.12,18.1 C15.1 | v61.75,11.59 62.71,10.64 77.31,10.64 80.65,7.3 C17.1 81.92,7.3 v82.39,6.83 | v55.88,36.51 57.15,37.78 R4.1 58.58,39.05 68.58,39.05 69.85,37.78 R3.1 v72.71,35.08 | v42.7,30.8 43.97,30.8 43.97,29.37 R43.1 44.13,29.21 v51.75,29.21 | v27.15,18.41 27.15,16.67 | 27.15,16.67 v27.15,14.29 | v39.37,13.65 39.37,16.67 27.15,16.67 | v31.75,43.66 30,43.66 29.85,43.5 C8.2 | 21.43,24.61 R42.1 | 21.43,24.61 21.43,25.08 C2.1 21.43,24.61 | 36.59,25.8 35.88,26.51 27.62,26.51 25.88,24.77 JP7.4 25.72,24.61 21.43,24.61 | 36.59,25.8 R5.2 | v32.39,34.61 27.62,29.84 IC4.OUT | 36.59,25.8 v36.83,26.04
VREF  (via drill 0.61)
  Top 0.254: v26.99,22.86 26.99,25.56 v30.96,29.53 | v67.79,36.04 78.26,36.04 78.58,36.35 v80.8,36.35
  Bottom 0.254: v26.99,22.86 28.26,21.59 R7.2 | v30.96,29.53 31.27,29.84 R8.1 32.7,29.84 37.94,35.08 66.68,35.08 67.63,36.04 v67.79,36.04 | IC13.3 82.55,36.35 | 82.55,36.35 82.55,36.04 | 82.55,36.04 IC13.12 | 85.09,36.04 IC13.10 | 82.55,36.04 85.09,36.04 | 85.09,36.04 IC13.5 85.09,41.27 102.71,41.27 103.51,40.48 IC14.3 103.51,36.04 | 103.51,36.04 IC14.12 | IC14.10 106.04,36.04 103.51,36.04 | 82.55,36.35 v80.8,36.35

### Text on the board
Top: 1 | 1 | 5 | 3 | 1
Bottom: El load_chip V01.0 | DK1RI